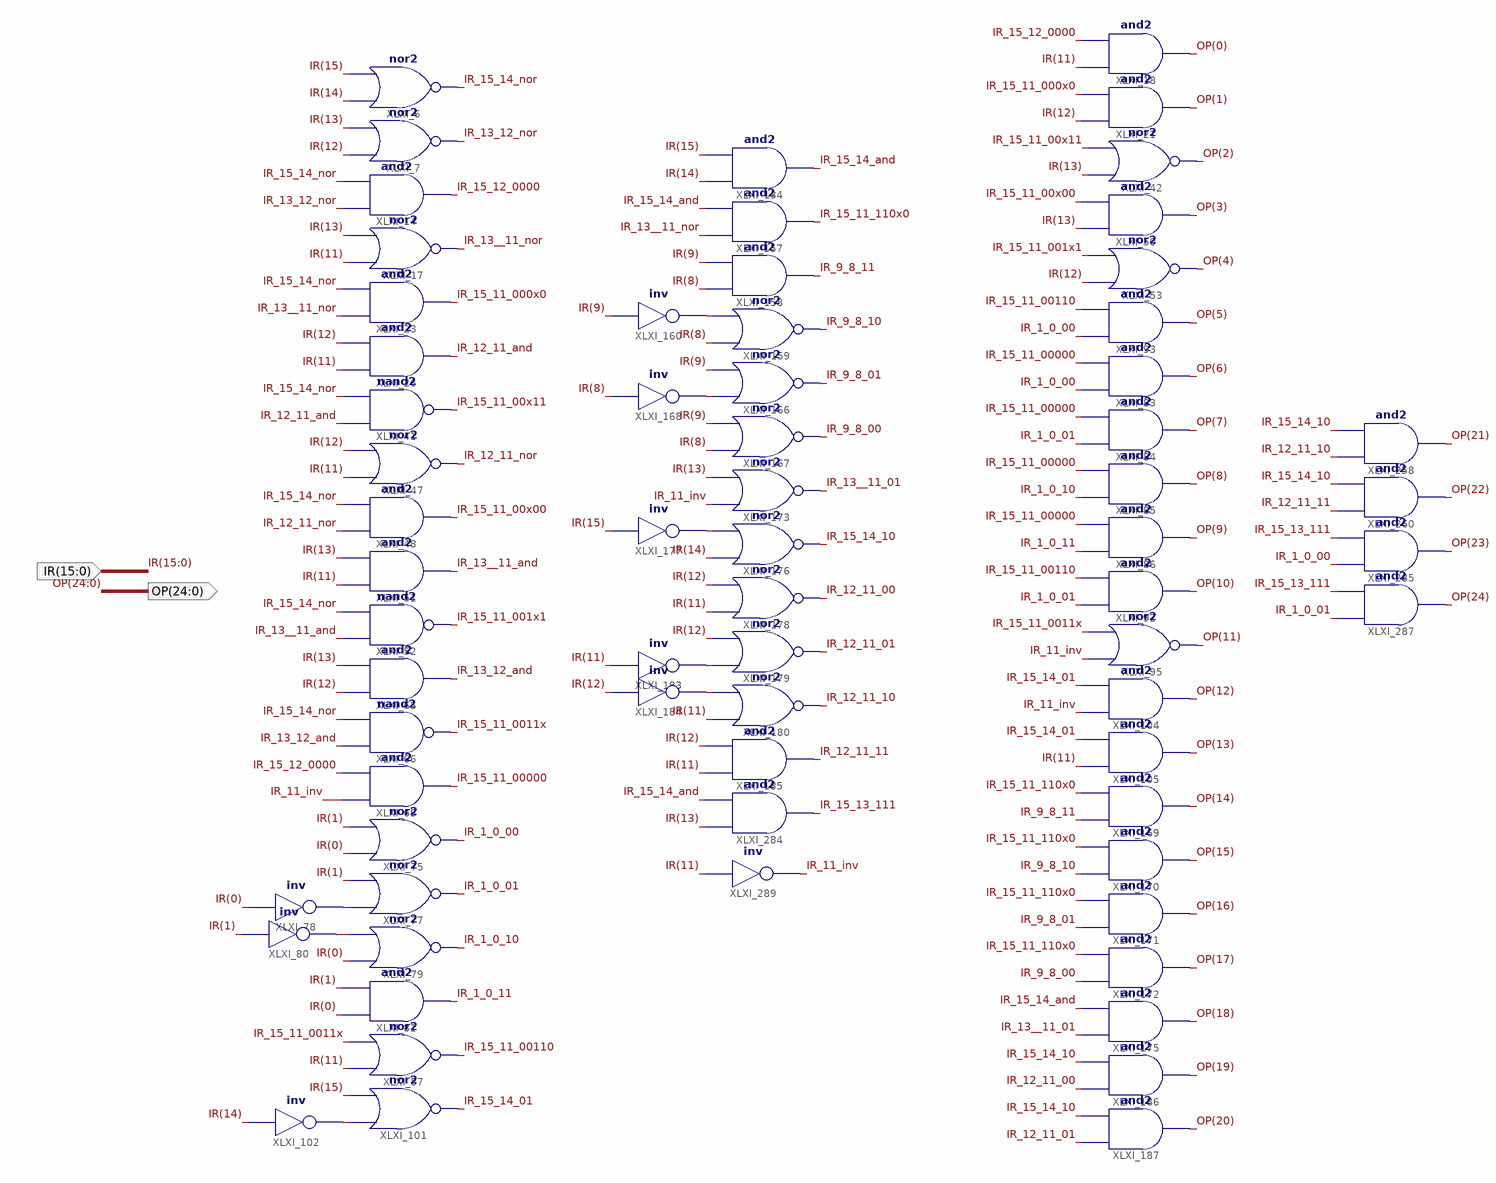
[diagram p0: schematic sheet 1]
// Xilinx ISE schematic InstrDec16.sch (virtex6) as structural Verilog: 67 symbols, 2 ports
module InstrDec16 (
  input  [15:0] IR,
  output [24:0] OP
);

  wire IR_1_0_00, IR_1_0_01, IR_1_0_10, IR_1_0_11, IR_9_8_00, IR_9_8_01, IR_9_8_10, IR_9_8_11, IR_11_inv,
       IR_12_11_00, IR_12_11_01, IR_12_11_10, IR_12_11_11, IR_12_11_and, IR_12_11_nor, IR_13_12_and,
       IR_13_12_nor, IR_13__11_01, IR_13__11_and, IR_13__11_nor, IR_15_11_00000, IR_15_11_000x0,
       IR_15_11_00x00, IR_15_11_00x11, IR_15_11_001x1, IR_15_11_0011x, IR_15_11_00110, IR_15_11_110x0,
       IR_15_12_0000, IR_15_13_111, IR_15_14_01, IR_15_14_10, IR_15_14_and, IR_15_14_nor, XLXN_201, XLXN_207,
       XLXN_262, XLXN_420, XLXN_437, XLXN_463, XLXN_471, XLXN_473;

  and XLXI_18 (OP[0], IR[11], IR_15_12_0000);
  and XLXI_21 (OP[1], IR[12], IR_15_11_000x0);
  nor XLXI_42 (OP[2], IR[13], IR_15_11_00x11);
  and XLXI_50 (OP[3], IR[13], IR_15_11_00x00);
  nor XLXI_53 (OP[4], IR[12], IR_15_11_001x1);
  and XLXI_83 (OP[6], IR_1_0_00, IR_15_11_00000);
  and XLXI_84 (OP[7], IR_1_0_01, IR_15_11_00000);
  and XLXI_85 (OP[8], IR_1_0_10, IR_15_11_00000);
  and XLXI_86 (OP[9], IR_1_0_11, IR_15_11_00000);
  and XLXI_92 (OP[10], IR_1_0_01, IR_15_11_00110);
  and XLXI_93 (OP[5], IR_1_0_00, IR_15_11_00110);
  nor XLXI_95 (OP[11], IR_11_inv, IR_15_11_0011x);
  and XLXI_104 (OP[12], IR_11_inv, IR_15_14_01);
  and XLXI_105 (OP[13], IR[11], IR_15_14_01);
  and XLXI_169 (OP[14], IR_9_8_11, IR_15_11_110x0);
  and XLXI_170 (OP[15], IR_9_8_10, IR_15_11_110x0);
  and XLXI_171 (OP[16], IR_9_8_01, IR_15_11_110x0);
  and XLXI_172 (OP[17], IR_9_8_00, IR_15_11_110x0);
  and XLXI_175 (OP[18], IR_13__11_01, IR_15_14_and);
  and XLXI_186 (OP[19], IR_12_11_00, IR_15_14_10);
  and XLXI_187 (OP[20], IR_12_11_01, IR_15_14_10);
  and XLXI_258 (OP[21], IR_12_11_10, IR_15_14_10);
  and XLXI_260 (OP[22], IR_12_11_11, IR_15_14_10);
  and XLXI_285 (OP[23], IR_1_0_00, IR_15_13_111);
  and XLXI_287 (OP[24], IR_1_0_01, IR_15_13_111);
  nor XLXI_6 (IR_15_14_nor, IR[14], IR[15]);
  nor XLXI_7 (IR_13_12_nor, IR[12], IR[13]);
  and XLXI_14 (IR_15_12_0000, IR_13_12_nor, IR_15_14_nor);
  nor XLXI_17 (IR_13__11_nor, IR[11], IR[13]);
  and XLXI_23 (IR_15_11_000x0, IR_13__11_nor, IR_15_14_nor);
  and XLXI_26 (IR_12_11_and, IR[11], IR[12]);
  nand XLXI_41 (IR_15_11_00x11, IR_12_11_and, IR_15_14_nor);
  nor XLXI_47 (IR_12_11_nor, IR[11], IR[12]);
  and XLXI_48 (IR_15_11_00x00, IR_12_11_nor, IR_15_14_nor);
  and XLXI_51 (IR_13__11_and, IR[11], IR[13]);
  nand XLXI_52 (IR_15_11_001x1, IR_13__11_and, IR_15_14_nor);
  and XLXI_65 (IR_13_12_and, IR[12], IR[13]);
  nand XLXI_66 (IR_15_11_0011x, IR_13_12_and, IR_15_14_nor);
  and XLXI_68 (IR_15_11_00000, IR_11_inv, IR_15_12_0000);
  nor XLXI_75 (IR_1_0_00, IR[0], IR[1]);
  nor XLXI_77 (IR_1_0_01, XLXN_201, IR[1]);
  not XLXI_78 (XLXN_201, IR[0]);
  nor XLXI_79 (IR_1_0_10, IR[0], XLXN_207);
  not XLXI_80 (XLXN_207, IR[1]);
  and XLXI_81 (IR_1_0_11, IR[0], IR[1]);
  nor XLXI_87 (IR_15_11_00110, IR[11], IR_15_11_0011x);
  nor XLXI_101 (IR_15_14_01, XLXN_262, IR[15]);
  not XLXI_102 (XLXN_262, IR[14]);
  and XLXI_134 (IR_15_14_and, IR[14], IR[15]);
  and XLXI_157 (IR_15_11_110x0, IR_13__11_nor, IR_15_14_and);
  and XLXI_158 (IR_9_8_11, IR[8], IR[9]);
  nor XLXI_159 (IR_9_8_10, IR[8], XLXN_420);
  not XLXI_160 (XLXN_420, IR[9]);
  nor XLXI_166 (IR_9_8_01, XLXN_437, IR[9]);
  nor XLXI_167 (IR_9_8_00, IR[8], IR[9]);
  not XLXI_168 (XLXN_437, IR[8]);
  nor XLXI_173 (IR_13__11_01, IR_11_inv, IR[13]);
  nor XLXI_176 (IR_15_14_10, IR[14], XLXN_463);
  not XLXI_177 (XLXN_463, IR[15]);
  nor XLXI_178 (IR_12_11_00, IR[11], IR[12]);
  nor XLXI_179 (IR_12_11_01, XLXN_471, IR[12]);
  nor XLXI_180 (IR_12_11_10, IR[11], XLXN_473);
  not XLXI_183 (XLXN_471, IR[11]);
  not XLXI_184 (XLXN_473, IR[12]);
  and XLXI_185 (IR_12_11_11, IR[11], IR[12]);
  and XLXI_284 (IR_15_13_111, IR[13], IR_15_14_and);
  not XLXI_289 (IR_11_inv, IR[11]);
endmodule
